# EAGLE design untitled (EAGLE 9.6.2)
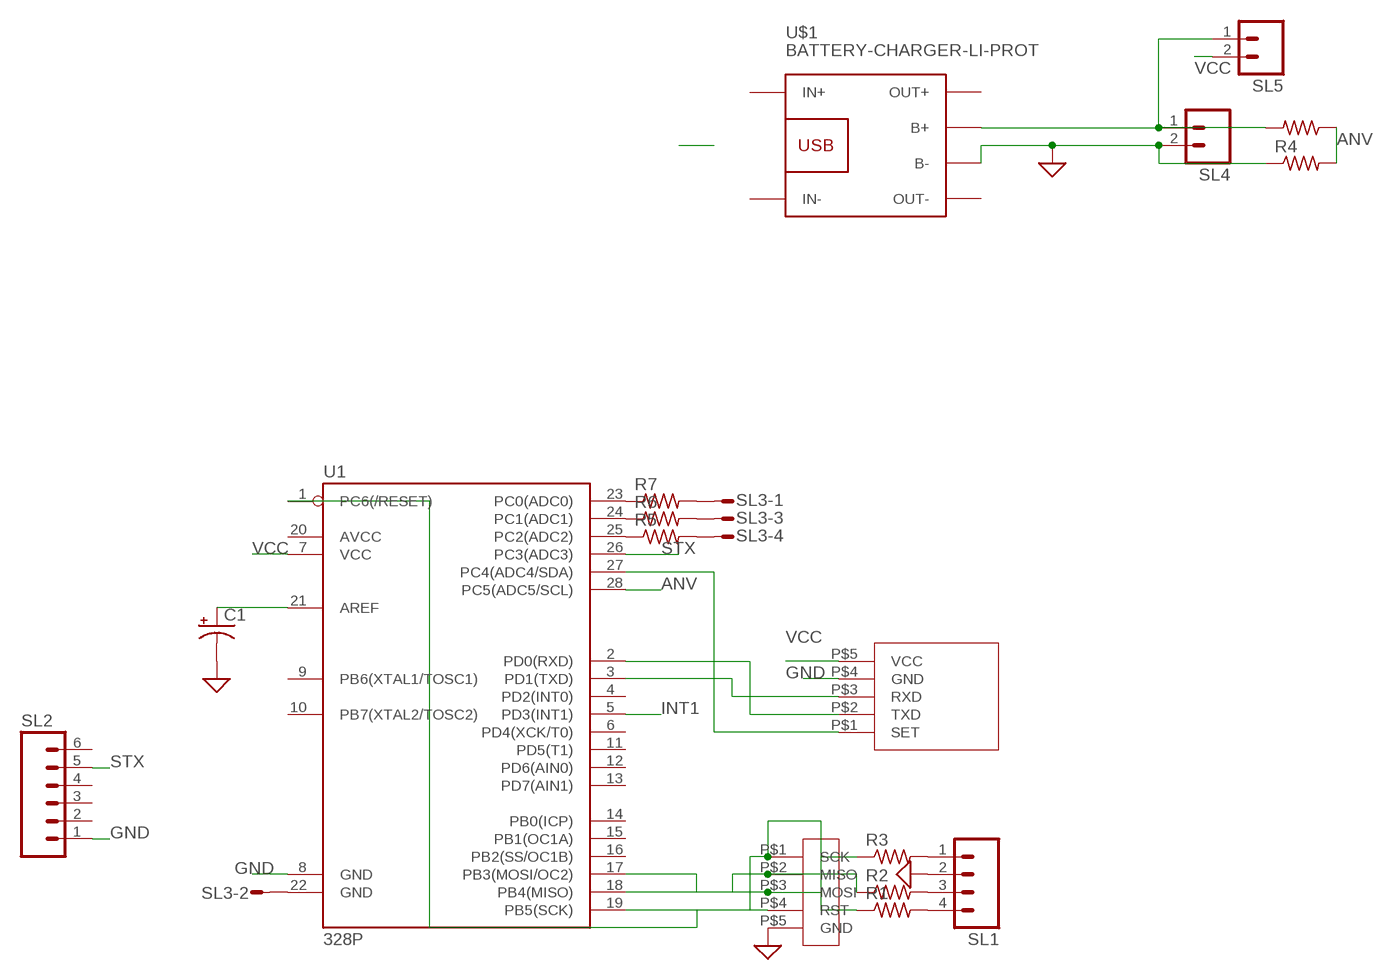
[diagram p0: schematic, sheet 1]

## Parts
C1  CAPACITOR-PE2.5-5  [E2,5-5]
R1  R-US_0204/2V  [0204V]
R2  R-US_0204/2V  [0204V]
R3  R-US_0207/7  [0207/7]
R4  R-US_0617/17  [0617/17]
R5  R-US_0204/2V  [0204V]
R6  R-US_0204/2V  [0204V]
R7  R-US_0207/5V  [0207/5V]
R8  R-US_0617/17  [0617/17]
SL1  M04  [04P]
SL2  M06  [06P]
SL3  M04S  [04P]
SL4  M02  [02P]
SL5  M02  [02P]
U1  328P  ATMEGA328P_PDIP  [DIP28]
U$1  BATTERY-CHARGER-LI-PROT  [BATTERY-CHARGER-LI-PROT]
U$2  MYISP  [MYISP]
U$3  HC12  [HC12]

## Nets
ANV: R4.2 R8.1 U1.28(PC5(ADC5/SCL))
GND: C1.- R4.1 SL1.2 SL2.1 SL4.2 U1.8(GND) U$1.B- U$2.P$5(GND) U$3.P$4(GND) ; supply symbol labelled SUP
INT1: U1.5(PD3(INT1))
N$1: C1.+ U1.21(AREF)
N$2: R1.2 SL1.4
N$3: R1.1 U1.19(PB5(SCK)) U$2.P$1(SCK)
N$4: R2.1 U1.18(PB4(MISO)) U$2.P$2(MISO)
N$5: R3.1 U1.17(PB3(MOSI/OC2)) U$2.P$3(MOSI)
N$6: U1.1(PC6(/RESET)) U$2.P$4(RST)
N$7: R2.2 SL1.3
N$8: R3.2 SL1.1
N$9: U1.27(PC4(ADC4/SDA)) U$3.P$1(SET)
N$11: U1.2(PD0(RXD)) U$3.P$2(TXD)
N$12: U1.3(PD1(TXD)) U$3.P$3(RXD)
N$13: SL3.2 U1.22(GND)
N$14: R5.1 U1.25(PC2(ADC2))
N$16: R5.2 SL3.4
N$17: R6.1 U1.24(PC1(ADC1))
N$18: R6.2 SL3.3
N$19: R7.1 U1.23(PC0(ADC0))
N$20: R7.2 SL3.1
N$24: R8.2 SL4.1 SL5.1 U$1.B+
STX: SL2.5 U1.26(PC3(ADC3))
VCC: SL5.2 U1.7(VCC) U$3.P$5(VCC)
Unconnected: SL2.2 SL2.3 SL2.4 SL2.6 U1.4(PD2(INT0)) U1.6(PD4(XCK/T0)) U1.9(PB6(XTAL1/TOSC1)) U1.10(PB7(XTAL2/TOSC2)) U1.11(PD5(T1)) U1.12(PD6(AIN0)) U1.13(PD7(AIN1)) U1.14(PB0(ICP)) U1.15(PB1(OC1A)) U1.16(PB2(SS/OC1B)) U1.20(AVCC) U$1.IN+ U$1.IN- U$1.OUT+ U$1.OUT-

## Library data of the parts
C1 = BeagleBone_Blue_R3:CAPACITOR-P: POLARIZED CAPACITOR, American symbol
R1-R8 = BeagleBone_Black_Wireless:R-US_: RESISTOR, American symbol
SL1 = con-amp-quick:M04: AMP QUICK CONNECTOR; OC_FARNELL: unknown; OC_NEWARK: unknown
SL2 = con-amp-quick:M06: AMP QUICK CONNECTOR; OC_FARNELL: unknown; OC_NEWARK: unknown
SL3 = con-amp-quick:M04S: AMP QUICK CONNECTOR; OC_FARNELL: unknown; OC_NEWARK: unknown
SL4 SL5 = con-amp-quick:M02: AMP QUICK CONNECTOR; OC_FARNELL: unknown; OC_NEWARK: unknown
U1 = SparkFun-IC-Microcontroller:ATMEGA328P_PDIP: Atmel 328P Through hole ATMEGA328P uC used in the Arduino 32kb flash, 1k EEPROM, 2k SRAM Datasheet <http://www.sparkfun.com/datasheets/Components/SMD/ATMega328.pdf> SparkFun Products Storefront component: AVR 28 Pin 20MHz 32K 6A/D - ATMega328P <https://www.sparkfun.com/products/9061> (COM-09061) SparkFun Simon Says - Through-Hole Soldering Kit <https://www.sparkfun.com/products/10547> (KIT-10547) SparkFun Learn to Solder - Simon Says <https://www.sparkfun.com/products/13708> (KIT-13708) SparkFun BigTime Watch Kit <https://www.sparkfun.com/products/11734> (KIT-11734) SparkFun ClockIt <https://www.sparkfun.com/products/10930> (KIT-10930) SparkFun Serial Enabled LCD Kit <https://www.sparkfun.com/products/10097> (LCD-10097) SparkFun Simon Tilts - Through Hole Soldering Kit <https://www.sparkfun.com/products/12634> (KIT-12634) SparkFun Frequency Counter Kit <https://www.sparkfun.com/products/10140> (KIT-10140) FabFM Radio Kit <https://www.sparkfun.com/products/11043> (KIT-11043) SparkFun Binary Blaster Kit <https://www.sparkfun.com/products/12037> (KIT-12037) SparkFun Metro-Gnome <https://www.sparkfun.com/products/9236> (KIT-09236) ATmega328 with Arduino Optiboot (Uno) <https://www.sparkfun.com/products/10524> (DEV-10524); PROD_ID: IC-09136
U$1 = diy-modules:BATTERY-CHARGER-LI-PROT: Lithium Battery 5V Charger with protection circuit More details available here: http://www.instructables.com/id/DIY-Lithium-ion-Battery-Charger/step4/TP4056-based-lithium-ion-battery-charger-module/ Click here to find device on ebay.com <http://www.ebay.com/sch/tp4056+charger+usb+protection>
U$2 = techart:MYISP
U$3 = techart:HC12

## Board
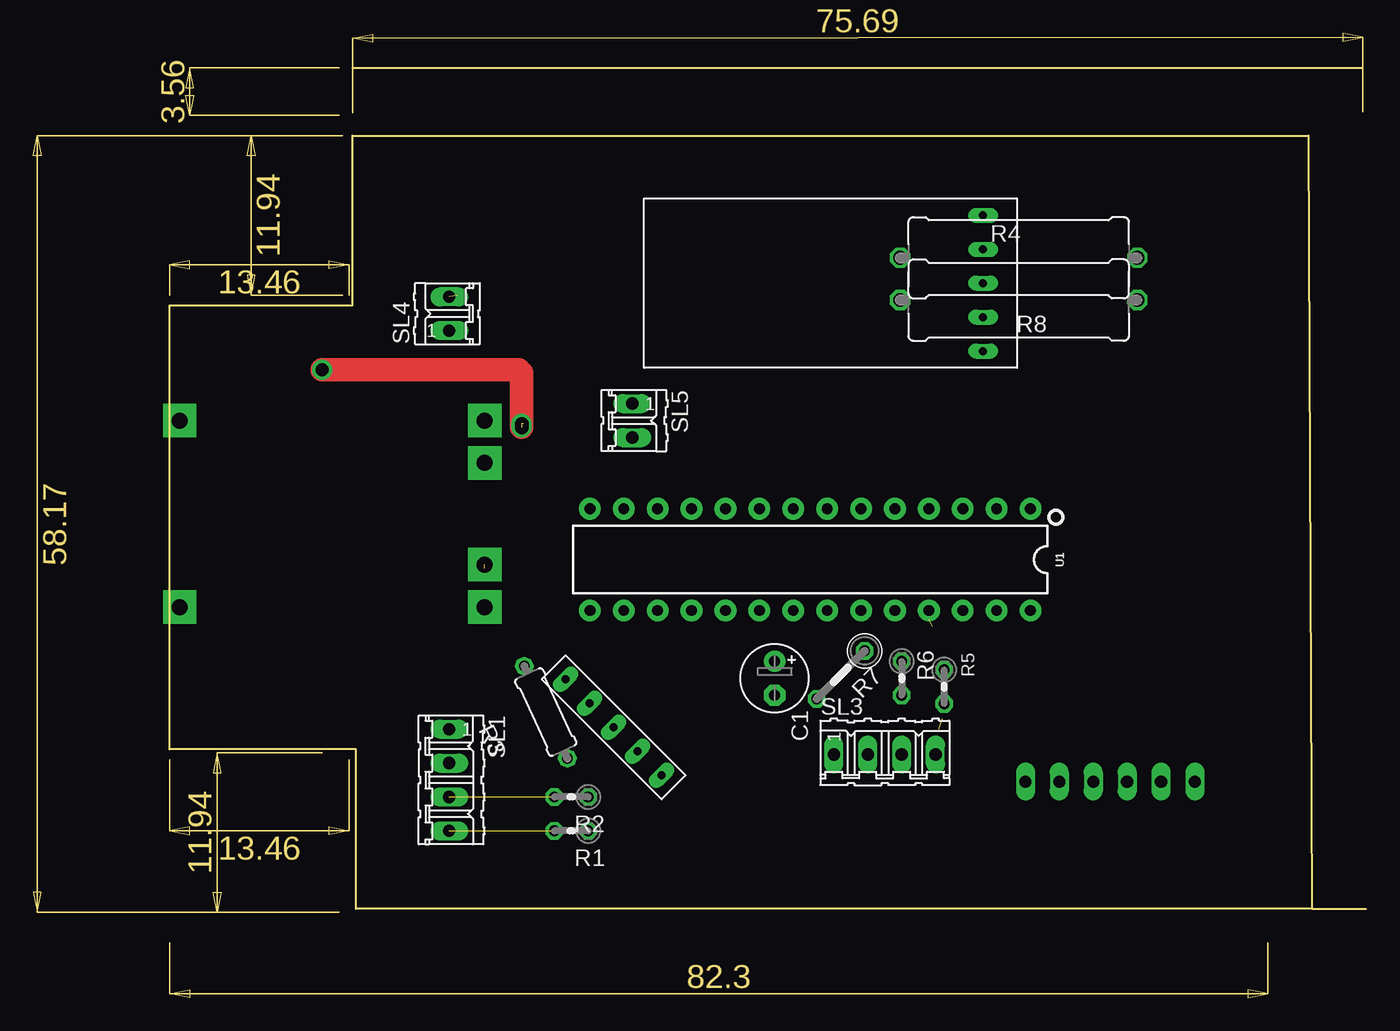
[diagram p1: board, top side]
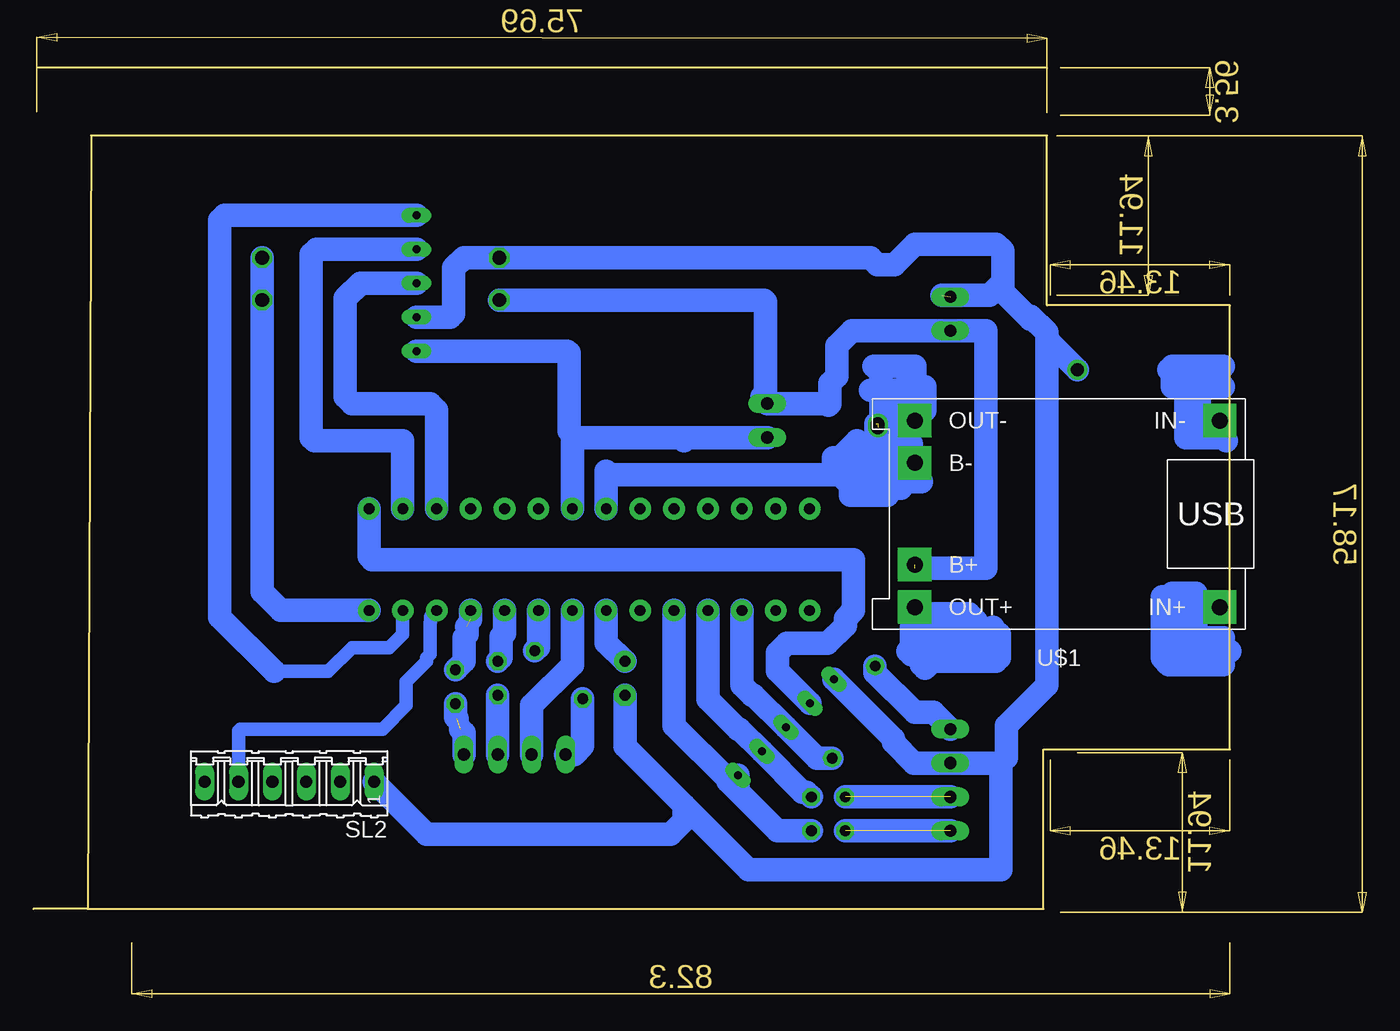
[diagram p2: board, bottom side, seen from below]

Size 89.66 x 62.99 mm. Coordinates in mm from the lower left corner, seen from the top.
Outline: 13.72,62.99 89.41,62.99
Outline: 85.6,0 85.34,57.91 13.72,57.91 13.72,45.21 0,45.21 0,11.94 13.97,11.94 13.97,0 85.6,0
Outline: 85.6,0 89.66,0
Copper layers (1*16): Top 0.035mm / dielectric 1.5mm / Bottom 0.035mm
Design rules "default *": minimum track width 6mil, minimum drill 0.35mm, track to track 30mil, track to pad 30mil, pad to pad 30mil, via to via 30mil, smd to smd 6mil, copper to edge 40mil, drill to drill 6mil, minimum pad ring 10mil, minimum via ring 8mil, stop-mask expansion 4mil, vias tented up to drill 0mil, thermal gap 10mil

### Footprints (pad centres in the part's own frame; a part is rotated, then mirrored left to right if it is on the bottom)
E2,5-5 = drill 0.813 pad 1.6: + -1.27,0 | drill 0.813 pad 1.6 octagon: - 1.27,0
0204V = drill 0.813 octagon: 1 -1.27,0; 2 1.27,0
0207/7 = drill 0.813 octagon: 1 -3.81,0; 2 3.81,0
0617/17 = drill 1.016 octagon: 1 -8.89,0; 2 8.89,0
0207/5V = drill 0.813 octagon: 1 -2.54,0; 2 2.54,0
04P = drill 0.914 long: 1 -3.81,0; 2 -1.27,0; 3 1.27,0; 4 3.81,0
06P = drill 0.914 long: 1 -6.35,0; 2 -3.81,0; 3 -1.27,0; 4 1.27,0; 5 3.81,0; 6 6.35,0
02P = drill 0.914 long: 1 -1.27,0; 2 1.27,0
DIP28 = drill 0.813 pad 1.626: 1 -16.51,-3.81; 2 -13.97,-3.81; 3 -11.43,-3.81; 4 -8.89,-3.81; 5 -6.35,-3.81; 6 -3.81,-3.81; 7 -1.27,-3.81; 8 1.27,-3.81; 9 3.81,-3.81; 10 6.35,-3.81; 11 8.89,-3.81; 12 11.43,-3.81; 13 13.97,-3.81; 14 16.51,-3.81; 15 16.51,3.81; 16 13.97,3.81; 17 11.43,3.81; 18 8.89,3.81; 19 6.35,3.81; 20 3.81,3.81; 21 1.27,3.81; 22 -1.27,3.81; 23 -3.81,3.81; 24 -6.35,3.81; 25 -8.89,3.81; 26 -11.43,3.81; 27 -13.97,3.81; 28 -16.51,3.81
BATTERY-CHARGER-LI-PROT = drill 1.2 pad 2.5 square: B+ 10.795,3.81; B- 10.795,-3.81; IN+ -12.065,6.985; IN- -12.065,-6.985; OUT+ 10.795,6.985; OUT- 10.795,-6.985
MYISP = drill 0.6 long: P$1 0,5.08; P$2 0,2.54; P$3 0,0; P$4 0,-2.54; P$5 0,-5.08
HC12 = drill 0.6 long: P$1 5.08,5.08; P$2 5.08,2.54; P$3 5.08,0; P$4 5.08,-2.54; P$5 5.08,-5.08

### Placement (x,y rotation side)
C1  45.34,17.27 270 top
R1  30.1,5.84 180 top
R2  30.1,8.38 180 top
R3  28.19,14.73 115 top
R4  63.63,48.77 0 top
R5  58.04,16.64 270 top
R6  54.86,17.27 270 top
R7  50.29,17.53 225 top
R8  63.63,45.59 180 top
SL1  20.95,9.65 270 top
SL2  70.48,9.52 180 bottom
SL3  53.59,11.56 0 top
SL4  20.95,44.58 90 top
SL5  34.67,36.58 270 top
U1  48.01,26.16 180 top
U$1  12.83,29.59 180 bottom
U$2  33.27,13.59 225 top
U$3  55.88,46.86 0 top

### Tracks (layer width: path | path; a pad name or v marks a point on that pad's centre or on a via)
ANV
  Bottom 1.778: R4.2 R8.1 72.52,23.75 71.12,22.35 U1.28
GND  (via drill 1)  (3 unrouted)
  Top 1.778: v26.38,36.07 26.38,40.16 26.16,40.39 v11.43,40.39
  Bottom 1.778: U$2.P$5 25.23,12.72 25.23,12.48 23.66,10.92 SL1.2 17.14,10.92 | C1.- 45.34,12.19 40.89,7.75 | 17.14,10.92 17.14,2.92 36.07,2.92 40.89,7.75 | 40.89,7.75 40.89,6.6 41.91,5.59 60.2,5.59 SL2.1 | U$3.P$4 58.42,44.32 58.17,44.58 58.17,48.01 57.4,48.77 R4.1 26.92,48.77 26.42,48.26 25.15,48.26 23.62,49.78 17.53,49.78 17.02,49.28 17.02,46.99 | U1.8 46.74,32.51 | 46.74,32.51 46.74,32.77 | 46.74,32.51 29.21,32.51 28.32,33.4 26.16,33.4 | 17.02,46.99 18.03,45.97 21.59,45.97 | U$1.B- 26.16,33.4 | 17.02,46.99 17.02,46.23 14.93,44.15 14.93,44.39 13.72,43.17 13.72,42.41 | 17.14,10.92 16.76,11.3 16.76,13.72 13.72,16.76 13.72,42.41 | 26.16,33.4 26.16,34.28 26.52,34.64 26.52,36.32 | v11.43,40.39 13.45,42.41 13.72,42.41
  other vias: 26.38,36.32
N$1
  Bottom 1.778: C1.+ 46.74,19.94 U1.21
N$2  (1 unrouted)
  Bottom 1.778: SL1.4 R1.2
N$3
  Bottom 1.778: R1.1 33.91,5.84 37.63,9.56 37.63,9.7 | U$2.P$1 36.87,8.94 37.63,9.7 | U1.19 41.66,13.73 37.63,9.7
N$4
  Bottom 1.778: U1.18 39.12,15.71 36.87,13.46 36.74,13.46 U$2.P$2 32.02,8.74 31.73,8.74 R2.1
N$5
  Bottom 1.778: R3.1 30.96,11.28 U$2.P$3 35.69,16 35.81,16 36.58,16.76 U1.17
N$6
  Bottom 1.524: 32.27,20.02 32.4,19.89
  Bottom 1.778: U$2.P$4 33.91,17.82 33.91,19.18 33.2,19.89 32.4,19.89 30.15,19.89 28.83,21.21 28.83,21.72 28.19,22.35 28.19,26.16 64.26,26.16 64.52,26.42 U1.1
N$7  (1 unrouted)
  Bottom 1.778: SL1.3 R2.2
N$8
  Bottom 1.778: SL1.1 22.23,14.73 23.62,14.73 26.58,17.69 R3.2
N$9
  Bottom 1.016: 71.63,17.78 67.56,17.78 65.79,19.56 62.99,19.56 61.98,20.57 U1.27
  Bottom 1.778: U$3.P$1 75.31,51.94 75.69,51.56 75.69,21.84 71.63,17.78
N$10
  Bottom 1.778: 0.51,39.12 2.03,39.12 2.29,38.86 2.29,35.31 | 2.29,35.31 0.51,35.31 0.25,35.05 | 2.29,35.31 3.3,35.31 3.3,40.64 | 3.3,40.64 0.51,40.64 | 3.3,40.64 4.32,40.64 4.57,40.39 4.32,40.13 4.32,39.12
N$11
  Bottom 1.778: U1.2 61.98,35.05 68.58,35.05 68.83,35.31 68.83,49.02 68.45,49.4 U$3.P$2
N$12
  Bottom 1.778: U1.3 59.44,37.34 59.94,37.85 65.79,37.85 66.29,38.35 66.29,45.72 65.15,46.86 U$3.P$3
N$13
  Bottom 1.778: SL3.2 52.32,15.24 49.28,18.29 U1.22
N$14  (1 unrouted)
  Bottom 1.778: U1.25 56.9,21.7 | 57.91,18.03 R5.1 57.4,18.54 57.4,20.32 57.15,20.57 57.15,21.08 57.19,21.12 57.15,21.15
N$15
  Bottom 1.778: 0.51,20.32 2.29,20.32 2.54,20.57 2.54,23.62 4.32,23.62 3.81,23.11 3.81,19.81 3.3,19.3 | 3.3,19.3 0,19.3 | 3.3,19.3 4.83,19.3 5.08,19.56 | 5.08,19.56 5.08,23.37 | 5.08,19.56 5.08,18.8 4.57,18.29 0.51,18.29
N$16  (1 unrouted)
  Bottom 1.778: SL3.4 57.4,13.21 57.66,13.46 | R5.2 58.04,14.35 57.91,14.22
N$17
  Bottom 1.778: R6.1 54.61,18.8 54.61,20.39 54.36,20.65 U1.24
N$18
  Bottom 1.778: R6.2 SL3.3
N$19
  Bottom 1.778: R7.1 51.82,19.59 U1.23
N$20
  Bottom 1.778: R7.2 48.5,12.21 49.15,11.56 SL3.1
N$21
  Bottom 1.778: 23.37,22.1 19.56,22.1 19.3,21.84 19.56,21.59 19.56,20.83 23.62,20.83 23.88,21.08 23.88,20.07 19.3,20.07 19.05,20.32 | 19.05,20.32 19.05,21.59 | 19.05,20.32 19.05,19.81 18.8,19.56 19.05,19.3 24.13,19.3 23.88,19.05 21.59,19.05 21.34,18.8 18.54,18.8 18.54,20.32 17.78,21.08 17.78,18.54 | 17.78,18.54 21.59,18.54 | 21.59,18.54 19.56,20.57 17.27,20.57 17.27,18.8 17.53,18.54 17.78,18.54 | 21.59,18.54 22.35,18.54 22.86,18.03 23.11,18.29 23.11,18.54
N$22
  Bottom 1.778: 24.13,38.1 23.62,38.61 23.62,40.64 26.67,40.64 26.16,40.13 26.16,33.53 26.92,32.77 26.16,32 23.11,32
N$23
  Bottom 1.778: 26.92,38.86 24.64,38.86 24.38,39.12 22.86,39.12 22.86,37.34 23.88,36.32 24.64,36.32 24.64,37.59 24.89,37.34 24.89,35.31 | 24.89,35.31 24.89,33.27 23.88,34.29 23.88,34.8 24.38,34.8 24.64,35.05 | 24.89,35.31 24.64,35.05 | 24.64,35.05 24.64,31.5 27.94,31.5 27.94,32.26 28.19,32.51 28.19,34.29 27.94,34.54 27.94,35.05 29.21,33.78 29.72,33.78 29.72,33.02 28.45,31.75 28.45,30.99 25.65,30.99 25.65,31.24
N$24  (1 unrouted)
  Bottom 1.778: 29.97,37.85 30.1,37.72 | 29.97,37.85 SL5.1 35.05,38.23 35.05,38.35 34.8,38.61 34.8,45.47 34.92,45.59 R8.2 | 29.97,37.85 29.97,39.37 29.46,39.88 29.46,42.16 28.32,43.31 SL4.1 18.29,43.31 18.29,25.51 23.62,25.51
STX
  Bottom 1.016: U1.26 59.89,21.89 59.89,21.49 59.94,21.44 59.94,19.05 60.2,18.8 60.2,18.54 61.72,17.02 61.72,15.24 63.5,13.46 74.17,13.46 74.3,13.33 SL2.5
VCC
  Bottom 1.778: 49.28,35.56 U1.7 | SL5.2 40.64,35.31 | 40.64,35.31 40.89,35.05 | 40.64,35.31 49.02,35.31 49.28,35.56 | 49.28,35.56 49.53,35.81 49.53,41.66 49.66,41.78 U$3.P$5